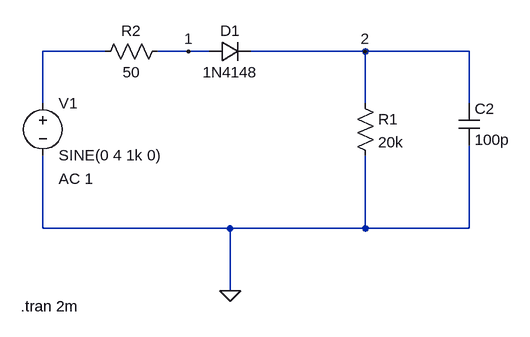
[diagram p0: schematic Auf_3.3_.asc]
Auf_3.3_.asc, the LTspice schematic file:
Version 4
SHEET 1 880 680
WIRE 96 48 0 48
WIRE 224 48 176 48
WIRE 256 48 224 48
WIRE 496 48 320 48
WIRE 656 48 496 48
WIRE 0 128 0 48
WIRE 496 128 496 48
WIRE 656 128 656 48
WIRE 0 320 0 208
WIRE 288 320 0 320
WIRE 496 320 496 208
WIRE 496 320 288 320
WIRE 656 320 656 192
WIRE 656 320 496 320
WIRE 288 416 288 320
FLAG 288 416 0
FLAG 224 48 1
FLAG 496 48 2
SYMBOL voltage 0 112 R0
WINDOW 123 24 132 Left 0
WINDOW 39 0 0 Left 0
SYMATTR InstName V1
SYMATTR Value SINE(0 4 1k 0)
SYMATTR Value2 AC 1
SYMBOL diode 256 64 R270
WINDOW 0 32 32 VTop 0
WINDOW 3 0 32 VBottom 0
SYMATTR InstName D1
SYMATTR Value 1N4148
SYMBOL res 480 112 R0
SYMATTR InstName R1
SYMATTR Value 20k
SYMBOL cap 640 128 R0
SYMATTR InstName C2
SYMATTR Value 100p
SYMBOL res 192 32 R90
WINDOW 0 0 56 VBottom 0
WINDOW 3 32 56 VTop 0
SYMATTR InstName R2
SYMATTR Value 50
TEXT -34 440 Left 0 !.tran 2m

The netlist it stands for:
* Auf_3.3_.asc
V1 N001 0 SINE(0 4 1k 0) AC 1
D1 1 2 1N4148
R1 2 0 20k
C2 2 0 100p
R2 1 N001 50
.model D D
.lib standard.dio
.tran 2m
.backanno
.end